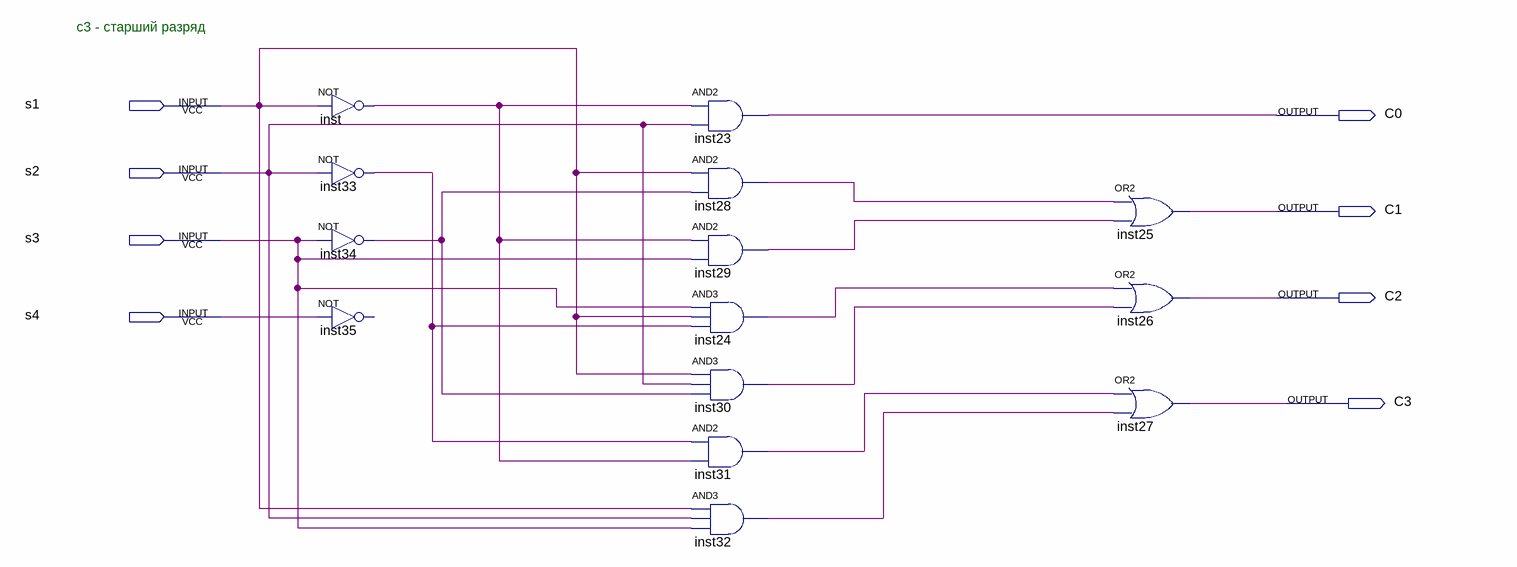
[diagram p0: schematic sheet]
// Quartus schematic enccoder_nda2_3.bdf as structural Verilog: 14 symbols, 8 pins
module enccoder_nda2_3 (
  input  s1,
  input  s2,
  input  s3,
  input  s4,
  output C0,
  output C1,
  output C2,
  output C3
);

  wire inst24_out, inst28_out, inst29_out, inst30_out, inst31_out, inst32_out, inst33_out, inst34_out,
       inst_out;

  not inst (inst_out, s1);
  not inst33 (inst33_out, s2);
  not inst34 (inst34_out, s3);
  // NOT inst35 has open pins: IN=s4, OUT=open
  and inst23 (C0, inst_out, s2);
  and inst28 (inst28_out, s1, inst34_out);
  and inst29 (inst29_out, inst_out, s3);
  and inst24 (inst24_out, s3, s1, inst33_out);
  and inst30 (inst30_out, s1, s2, inst34_out);
  and inst31 (inst31_out, inst33_out, inst_out);
  and inst32 (inst32_out, s1, s2, s3);
  or inst25 (C1, inst28_out, inst29_out);
  or inst26 (C2, inst24_out, inst30_out);
  or inst27 (C3, inst31_out, inst32_out);

  // Notes on the sheet:
  //   с3 - старший разряд
endmodule
